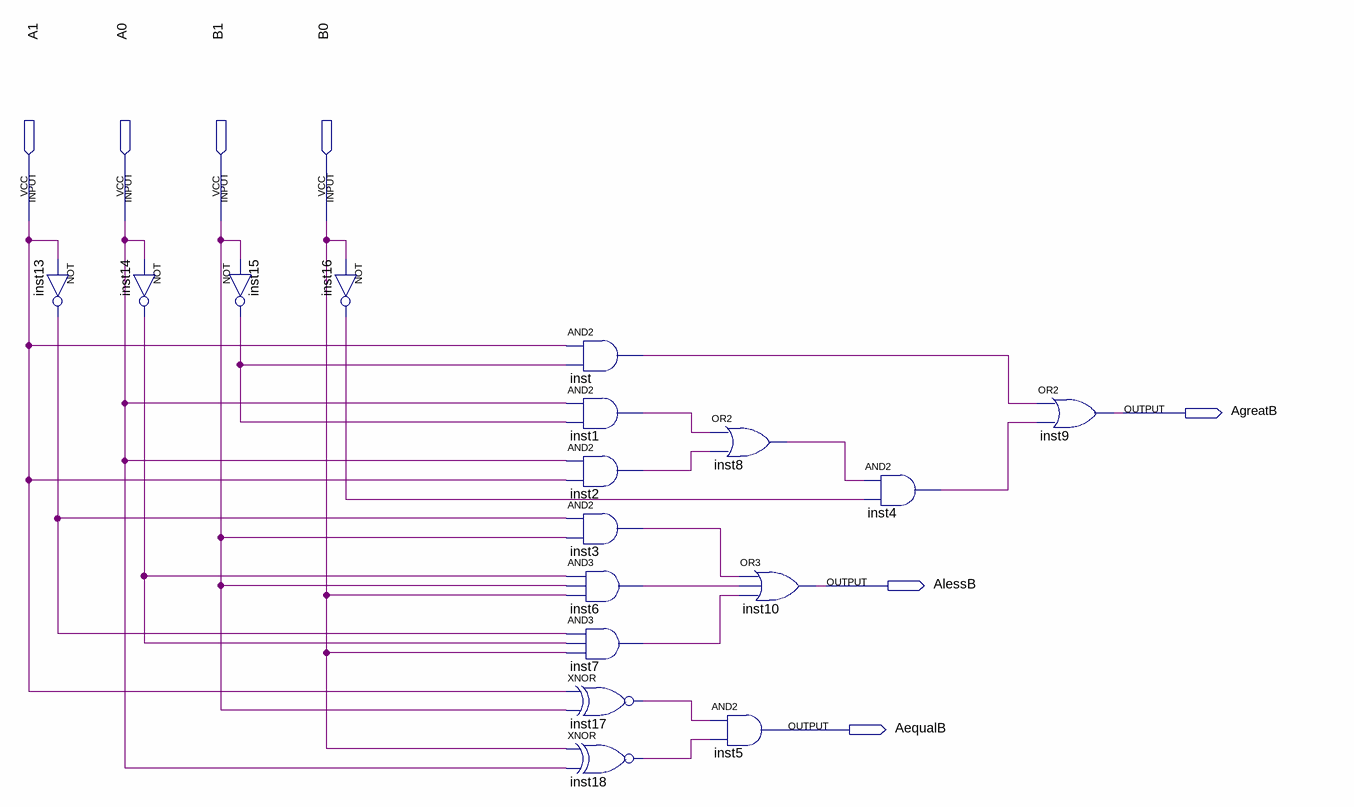
[diagram p0: schematic sheet]
// Quartus schematic 1.bdf as structural Verilog: 17 symbols, 7 pins
module \1  (
  input  A1,
  input  A0,
  input  B1,
  input  B0,
  output AgreatB,
  output AlessB,
  output AequalB
);

  wire inst1_out, inst2_out, inst3_out, inst4_out, inst6_out, inst7_out, inst8_out, inst13_out, inst14_out,
       inst15_out, inst16_out, inst17_out, inst18_out, inst_out;

  not inst13 (inst13_out, A1);
  not inst14 (inst14_out, A0);
  not inst15 (inst15_out, B1);
  not inst16 (inst16_out, B0);
  and inst (inst_out, A1, inst15_out);
  and inst1 (inst1_out, A0, inst15_out);
  and inst2 (inst2_out, A0, A1);
  and inst3 (inst3_out, inst13_out, B1);
  and inst6 (inst6_out, inst14_out, B1, B0);
  and inst7 (inst7_out, inst13_out, inst14_out, B0);
  xnor inst17 (inst17_out, A1, B1);
  xnor inst18 (inst18_out, B0, A0);
  or inst8 (inst8_out, inst1_out, inst2_out);
  and inst5 (AequalB, inst17_out, inst18_out);
  or inst10 (AlessB, inst3_out, inst6_out, inst7_out);
  and inst4 (inst4_out, inst8_out, inst16_out);
  or inst9 (AgreatB, inst_out, inst4_out);
endmodule
